# EAGLE board PowerManagementSchem (EAGLE 9.4.2)
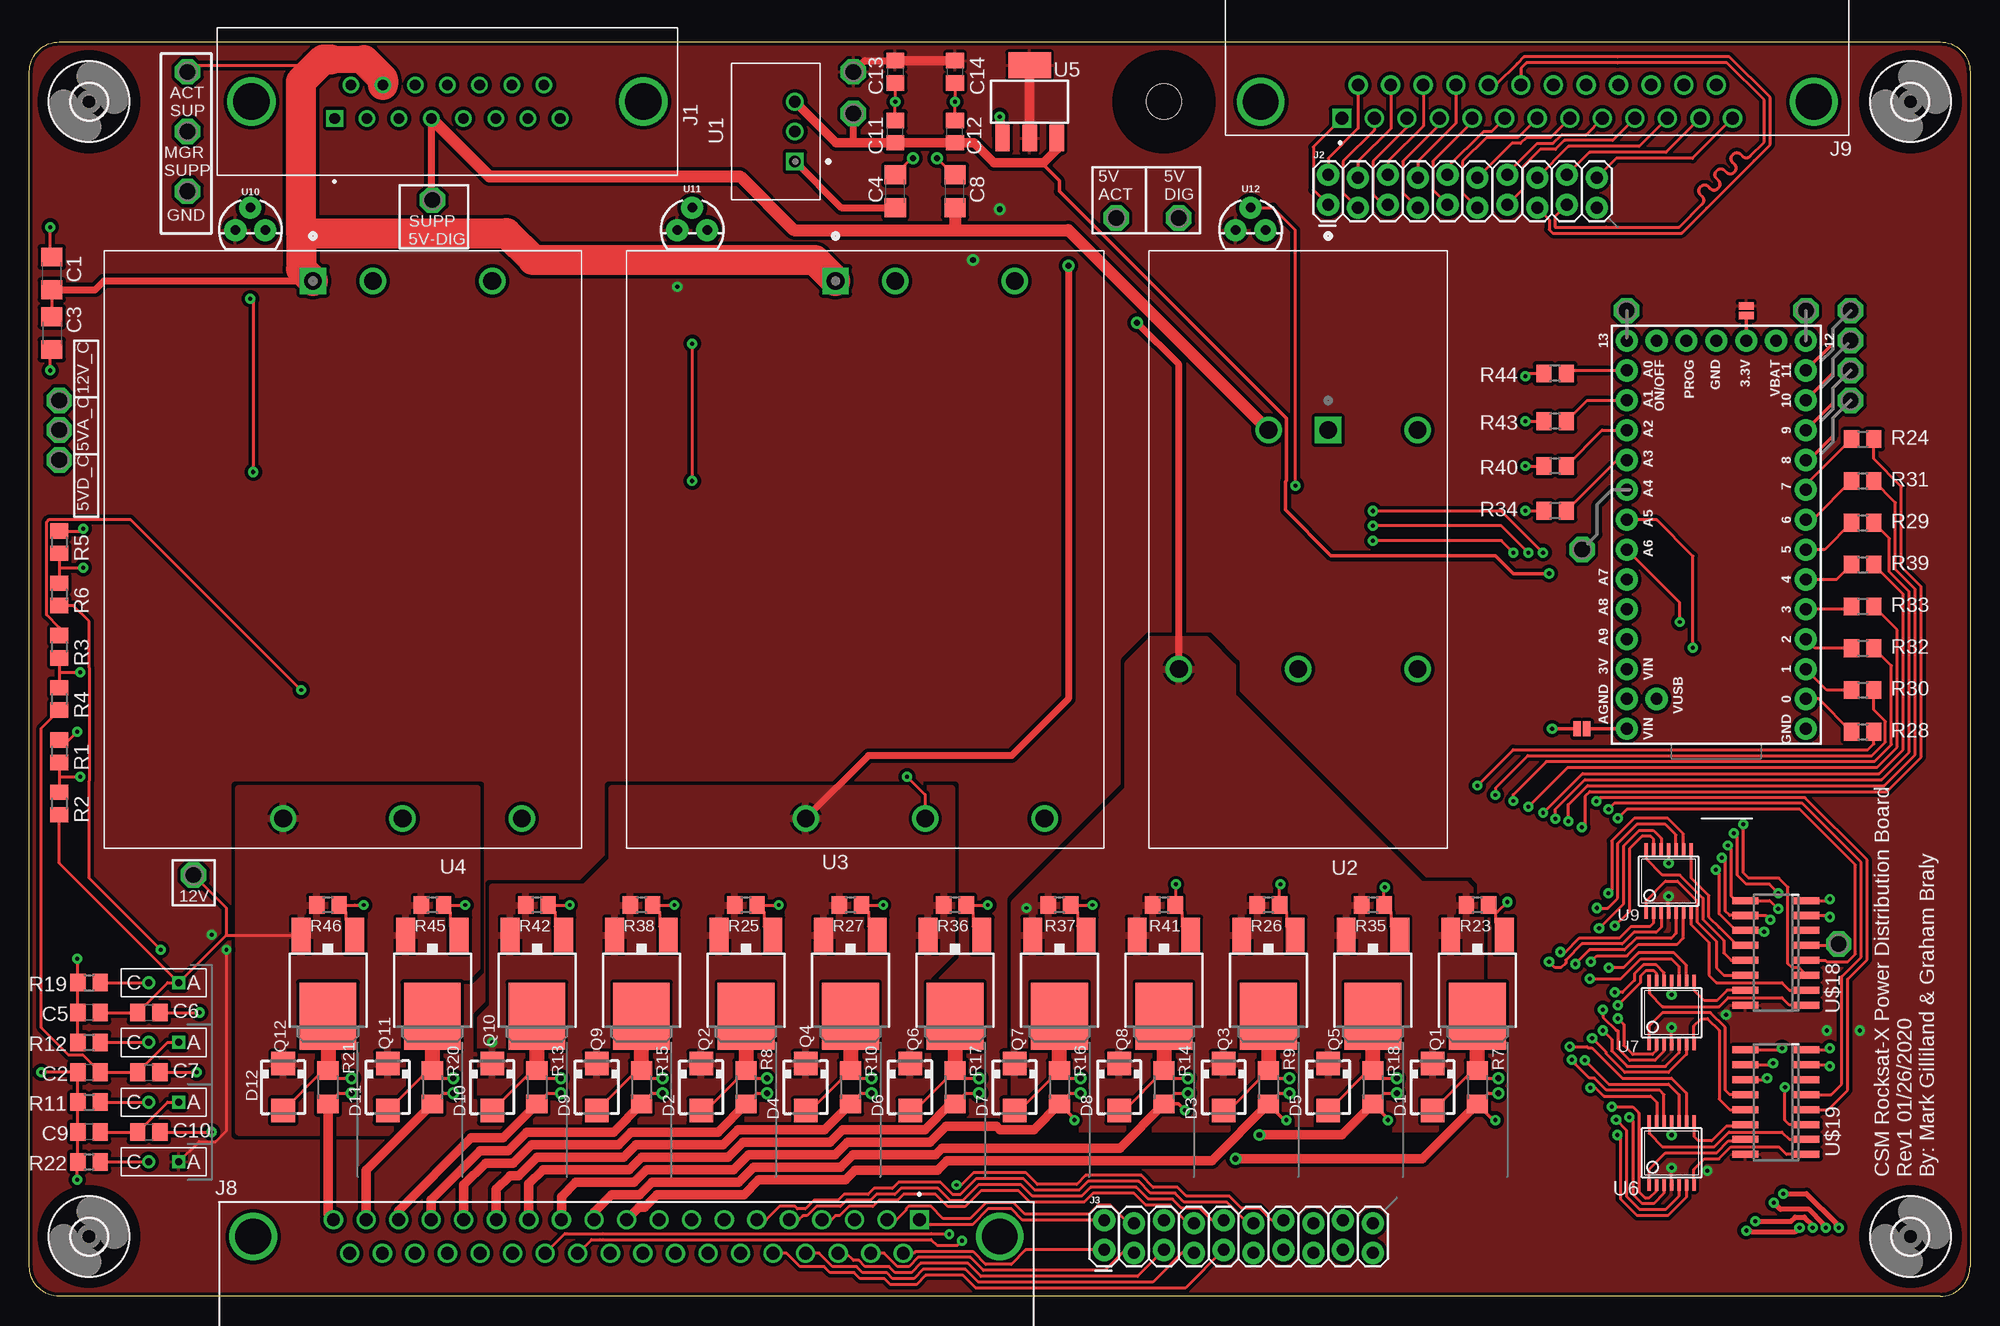
[diagram p5: board, top side]
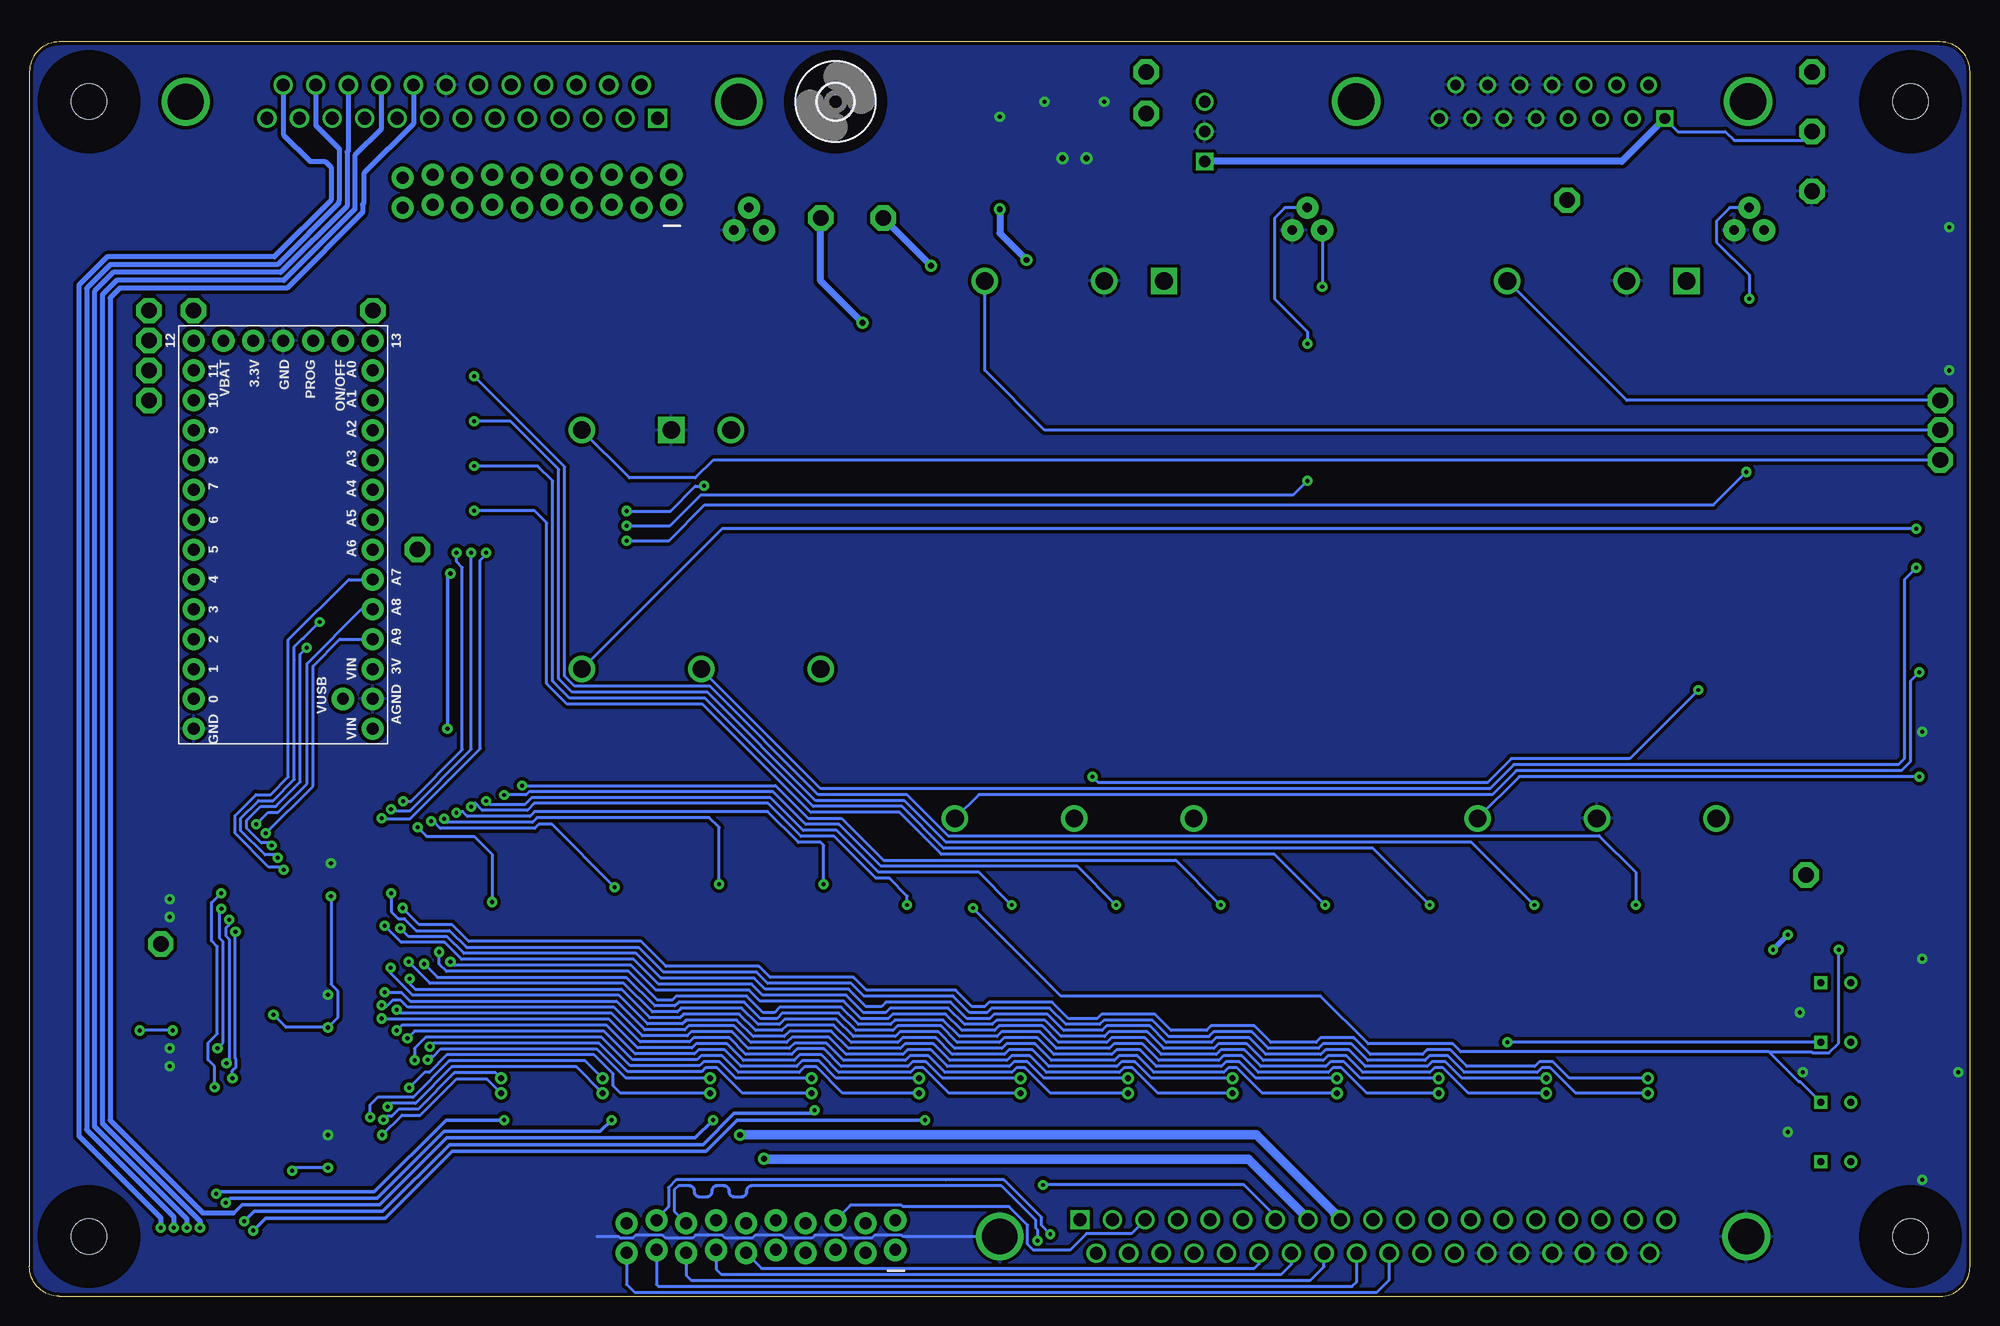
[diagram p6: board, bottom side, seen from below]

Size 165.1 x 106.68 mm. Coordinates in mm from the lower left corner, seen from the top.
Outline: 0,2.54 0,104.14 arc-90 2.54,106.68 162.56,106.68 arc-90 165.1,104.14 165.1,2.54 arc-90 162.56,0 2.54,0 arc-90 0,2.54
Copper layers (1*16): Top 0.035mm / dielectric 1.5mm / Bottom 0.035mm
Design rules "SparkFun-2-layer-STANDARD_13milDrill": minimum track width 10mil, minimum drill 13mil, track to track 10mil, track to pad 8mil, pad to pad 8mil, via to via 10mil, smd to smd 8mil, copper to edge 8mil, drill to drill 8mil, minimum pad ring 10mil, minimum via ring 10mil, stop-mask expansion 4mil, vias tented up to drill 25mil, thermal gap 10mil
Net classes: 1 USB_DIFF_PAIR: width 0.203 mm, clearance 0.203 mm to class 0, clearance 0.203 mm; 2 hv-lines: clearance 0.254 mm to class 0, clearance 0.254 mm to class 1, clearance 0.254 mm

## Footprints (pad centres in the part's own frame; a part is rotated, then mirrored left to right if it is on the bottom)
C1206 = smd 1.6 x 1.8: 1 -1.4,0; 2 1.4,0
C0805 = smd 1.3 x 1.5: 1 -0.95,0; 2 0.95,0
SMA = smd 2 x 2: A 2,0; C -2,0
3,0 = hole 3: 0,0
D15S24A4GV00LF = drill 0.9 square: 1 9.59,1.42 | drill 0.9: 2 6.85,1.42; 3 4.11,1.42; 4 1.37,1.42; 5 -1.37,1.42; 6 -4.11,1.42; 7 -6.85,1.42; 8 -9.59,1.42; 9 8.22,-1.42; 10 5.48,-1.42; 11 2.74,-1.42; 12 0,-1.42; 13 -2.74,-1.42; 14 -5.48,-1.42; 15 -8.22,-1.42 | drill 3.1: MH1 -16.66,0; MH2 16.66,0
2X10_LOCK = drill 1.016 pad 1.88: 1 0,0.127; 2 0,2.667; 3 2.54,-0.127; 4 2.54,2.413; 5 5.08,0.127; 6 5.08,2.667; 7 7.62,-0.127; 8 7.62,2.413; 9 10.16,0.127; 10 10.16,2.667; 11 12.7,-0.127; 12 12.7,2.413; 13 15.24,0.127; 14 15.24,2.667; 15 17.78,-0.127; 16 17.78,2.413; 17 20.32,0.127; 18 20.32,2.667; 19 22.86,-0.127; 20 22.86,2.413
182-037-213R531 = drill 1.09 square: 1 24.93,1.42 | drill 1.09: 2 22.16,1.42; 3 19.39,1.42; 4 16.62,1.42; 5 13.85,1.42; 6 11.08,1.42; 7 8.31,1.42; 8 5.54,1.42; 9 2.77,1.42; 10 0,1.42; 11 -2.77,1.42; 12 -5.54,1.42; 13 -8.31,1.42; 14 -11.08,1.42; 15 -13.85,1.42; 16 -16.62,1.42; 17 -19.39,1.42; 18 -22.16,1.42; 19 -24.93,1.42; 20 -23.545,-1.42; 21 -20.775,-1.42; 22 -18.005,-1.42; 23 -15.235,-1.42; 24 -12.465,-1.42; 25 -9.695,-1.42; 26 -6.925,-1.42; 27 -4.155,-1.42; 28 -1.385,-1.42; 29 1.385,-1.42; 30 4.155,-1.42; 31 6.925,-1.42; 32 9.695,-1.42; 33 12.465,-1.42; 34 15.235,-1.42; 35 18.005,-1.42; 36 20.775,-1.42; 37 23.545,-1.42 | drill 3.05: MH1 -31.75,0; MH2 31.75,0
182-025-213R531 = drill 1.09 square: 1 16.62,1.42 | drill 1.09: 2 13.85,1.42; 3 11.08,1.42; 4 8.31,1.42; 5 5.54,1.42; 6 2.77,1.42; 7 0,1.42; 8 -2.77,1.42; 9 -5.54,1.42; 10 -8.31,1.42; 11 -11.08,1.42; 12 -13.85,1.42; 13 -16.62,1.42; 14 15.235,-1.42; 15 12.465,-1.42; 16 9.695,-1.42; 17 6.925,-1.42; 18 4.155,-1.42; 19 1.385,-1.42; 20 -1.385,-1.42; 21 -4.155,-1.42; 22 -6.925,-1.42; 23 -9.695,-1.42; 24 -12.465,-1.42; 25 -15.235,-1.42 | drill 3.05: MH1 -23.52,0; MH2 23.52,0
SMT-JUMPER_2_NO_NO-SILK = smd 0.635 x 1.27: 1 -0.406,0; 2 0.406,0
DPAK = smd 1.6 x 3: 1 -2.28,-5.31; 3 2.28,-5.31 | smd 4.826 x 5.715: 4 0,1.588
R0805 = smd 1.3 x 1.5: 1 -0.95,0; 2 0.95,0
R1206 = smd 1.6 x 1.803: 1 -1.422,0; 2 1.422,0
P1-13 = drill 1.321 pad 2.159 octagon: TP 0,0
VX78012-500_VX7805-500 = drill 1 square: 1 -2.54,-1.625 | drill 1: 2 0,-1.625; 3 2.54,-1.625
CONV_PYB20-Q24-S5 = drill 1.5 square: 1 -10.16,2.54 | drill 1.5: 2 -10.16,-2.54; 3 10.16,-10.16; 4 10.16,0; 5 10.16,10.16; 6 -10.16,10.16
CONV_PYB30-Q48-S5 = drill 1.5 square: 1 -22.86,-2.54 | drill 1.5: 2 -22.86,2.54; 3 -22.86,12.7; 4 22.86,15.24; 5 22.86,5.08; 6 22.86,-5.08
CONV_PYB30-Q48-S12 = drill 1.5 square: 1 -22.86,-2.54 | drill 1.5: 2 -22.86,2.54; 3 -22.86,12.7; 4 22.86,15.24; 5 22.86,5.08; 6 22.86,-5.08
SOT223 = smd 1.219 x 2.235: 1 -2.311,-3.099; 2 0,-3.099; 3 2.311,-3.099 | smd 3.6 x 2.2: 4 0,3.099
TSSOP14 = smd 0.305 x 0.991: 1 -1.905,-2.718; 2 -1.27,-2.718; 3 -0.635,-2.718; 4 0,-2.718; 5 0.635,-2.718; 6 1.27,-2.718; 7 1.905,-2.718; 8 1.905,2.718; 9 1.27,2.718; 10 0.635,2.718; 11 0,2.718; 12 -0.635,2.718; 13 -1.27,2.718; 14 -1.905,2.718
TEENSY-4.0 = drill 1.016 pad 1.88: 0 7.62,-13.97; 1 7.62,-11.43; 2 7.62,-8.89; 3 7.62,-6.35; 3.3V 2.54,16.51; 3V -7.62,-11.43; 4 7.62,-3.81; 5 7.62,-1.27; 6 7.62,1.27; 7 7.62,3.81; 8 7.62,6.35; 9 7.62,8.89; 10 7.62,11.43; 11 7.62,13.97; 12 7.62,16.51; 13 -7.62,16.51; 14 -7.62,13.97; 15 -7.62,11.43; 16 -7.62,8.89; 17 -7.62,6.35; 18 -7.62,3.81; 19 -7.62,1.27; 20 -7.62,-1.27; 21 -7.62,-3.81; 22 -7.62,-6.35; 23 -7.62,-8.89; AGND -7.62,-13.97; GND 0,16.51; GND1 7.62,-16.51; ON/OFF -5.08,16.51; PROG -2.54,16.51; VBAT 5.08,16.51; VIN -7.62,-16.51; VUSB -5.08,-13.97
TO-92 = drill 0.813 pad 1.88: 1 -1.27,0; 2 0,1.905; 3 1.27,0
FLAT_LED = drill 0.6 square: ANODE 0,0 | drill 0.6: CATHODE 2.54,0
SOIC16N = smd 0.6 x 2.2: 1 -4.445,-2.6; 2 -3.175,-2.6; 3 -1.905,-2.6; 4 -0.635,-2.6; 5 0.635,-2.6; 6 1.905,-2.6; 7 3.175,-2.6; 8 4.445,-2.6; 9 4.445,2.6; 10 3.175,2.6; 11 1.905,2.6; 12 0.635,2.6; 13 -0.635,2.6; 14 -1.905,2.6; 15 -3.175,2.6; 16 -4.445,2.6

## Placement (x,y rotation side)
C1  10uF  [C1206]  1.91,87 90 top
C2  10uF  [C0805]  5.08,19.05 180 top
C3  10uF  [C1206]  1.91,81.92 270 top
C4  10uF  [C1206]  73.66,93.98 90 top
C5  10uF  [C0805]  5.08,24.13 180 top
C6  0.1uF  [C0805]  10.16,24.13 0 top
C7  0.1uF  [C0805]  10.16,19.05 0 top
C8  10uF  [C1206]  78.74,93.98 90 top
C9  10uF  [C0805]  5.08,13.97 180 top
C10  0.1uF  [C0805]  10.16,13.97 0 top
C11  10uF  [C0805]  73.66,99.06 90 top
C12  0.1uF  [C0805]  78.74,99.06 90 top
C13  10uF  [C0805]  73.66,104.14 270 top
C14  0.1uF  [C0805]  78.74,104.14 270 top
D1  S1M  [SMA]  119.38,17.78 270 top
D2  S1M  [SMA]  57.15,17.78 270 top
D3  S1M  [SMA]  101.6,17.78 270 top
D4  S1M  [SMA]  66.04,17.78 270 top
D5  S1M  [SMA]  110.49,17.78 270 top
D6  S1M  [SMA]  74.93,17.78 270 top
D7  S1M  [SMA]  83.82,17.78 270 top
D8  S1M  [SMA]  92.71,17.78 270 top
D9  S1M  [SMA]  48.26,17.78 270 top
D10  S1M  [SMA]  39.37,17.78 270 top
D11  S1M  [SMA]  30.48,17.78 270 top
D12  S1M  [SMA]  21.59,17.78 270 top
H1  MOUNT-HOLE3.0  [3,0]  160.02,101.6 0 top
H2  MOUNT-HOLE3.0  [3,0]  160.02,5.08 0 top
H3  MOUNT-HOLE3.0  [3,0]  5.08,101.6 0 top
H4  MOUNT-HOLE3.0  [3,0]  96.52,101.6 0 bottom
H6  MOUNT-HOLE3.0  [3,0]  5.08,5.08 0 top
J1  D15S24A4GV00LF  [D15S24A4GV00LF]  35.56,101.6 180 top
J2  [2X10_LOCK]  110.49,92.71 0 top
J3  [2X10_LOCK]  91.44,3.81 0 top
J8  182-037-213R531  [182-037-213R531]  50.8,5.08 0 top
J9  182-025-213R531  [182-025-213R531]  128.27,101.6 180 top
JP1  JUMPER-SMT_2_NO_NO-SILK  [SMT-JUMPER_2_NO_NO-SILK]  132.08,48.26 180 top
JP2  JUMPER-SMT_2_NO_NO-SILK  [SMT-JUMPER_2_NO_NO-SILK]  146.05,83.82 90 top
Q1  PMOSFET  [DPAK]  123.19,25.4 180 top
Q2  PMOSFET  [DPAK]  60.96,25.4 180 top
Q3  PMOSFET  [DPAK]  105.41,25.4 180 top
Q4  PMOSFET  [DPAK]  69.85,25.4 180 top
Q5  PMOSFET  [DPAK]  114.3,25.4 180 top
Q6  PMOSFET  [DPAK]  78.74,25.4 180 top
Q7  PMOSFET  [DPAK]  87.63,25.4 180 top
Q8  PMOSFET  [DPAK]  96.52,25.4 180 top
Q9  PMOSFET  [DPAK]  52.07,25.4 180 top
Q10  PMOSFET  [DPAK]  43.18,25.4 180 top
Q11  PMOSFET  [DPAK]  34.29,25.4 180 top
Q12  PMOSFET  [DPAK]  25.4,25.4 180 top
R1  DNP  [R0805]  2.54,46.35 270 top
R2  DNP  [R0805]  2.54,41.91 270 top
R3  DNP  [R0805]  2.54,55.24 270 top
R4  DNP  [R0805]  2.54,50.8 270 top
R5  DNP  [R0805]  2.54,64.14 270 top
R6  DNP  [R0805]  2.54,59.69 270 top
R7  0.01Ω  [R1206]  123.19,17.78 90 top
R8  0.01Ω  [R1206]  60.96,17.78 90 top
R9  0.01Ω  [R1206]  105.41,17.78 90 top
R10  0.01Ω  [R1206]  69.85,17.78 90 top
R11  330  [R0805]  5.08,16.51 0 top
R12  330  [R0805]  5.08,21.59 0 top
R13  0.01Ω  [R1206]  43.18,17.78 90 top
R14  0.01Ω  [R1206]  96.52,17.78 90 top
R15  0.01Ω  [R1206]  52.07,17.78 90 top
R16  0.01Ω  [R1206]  87.63,17.78 90 top
R17  0.01Ω  [R1206]  78.74,17.78 90 top
R18  0.01Ω  [R1206]  114.3,17.78 90 top
R19  1.2k  [R0805]  5.08,26.67 0 top
R20  0.01Ω  [R1206]  34.29,17.78 90 top
R21  0.01Ω  [R1206]  25.4,17.78 90 top
R22  330  [R0805]  5.08,11.43 0 top
R23  100k  [R0805]  123.19,33.27 180 top
R24  100Ω  [R0805]  155.96,72.9 0 top
R25  100k  [R0805]  60.96,33.27 180 top
R26  100k  [R0805]  105.41,33.27 180 top
R27  100k  [R0805]  69.85,33.27 180 top
R28  100Ω  [R0805]  155.96,48.01 0 top
R29  100Ω  [R0805]  155.96,65.79 0 top
R30  100Ω  [R0805]  155.96,51.56 0 top
R31  100Ω  [R0805]  155.96,69.34 0 top
R32  100Ω  [R0805]  155.96,55.12 0 top
R33  100Ω  [R0805]  155.96,58.67 0 top
R34  100Ω  [R0805]  129.79,66.8 180 top
R35  100k  [R0805]  114.3,33.27 180 top
R36  100k  [R0805]  78.74,33.27 180 top
R37  100k  [R0805]  87.63,33.27 180 top
R38  100k  [R0805]  52.07,33.27 180 top
R39  100Ω  [R0805]  155.96,62.23 0 top
R40  100Ω  [R0805]  129.79,70.61 180 top
R41  100k  [R0805]  96.52,33.27 180 top
R42  100k  [R0805]  43.18,33.27 180 top
R43  100Ω  [R0805]  129.79,74.42 180 top
R44  100Ω  [R0805]  129.79,78.49 180 top
R45  100k  [R0805]  34.29,33.27 180 top
R46  100k  [R0805]  25.4,33.27 180 top
TP1  TPPAD1-13  [P1-13]  13.46,93.98 180 top
TP2  TPPAD1-13  [P1-13]  34.29,93.22 180 top
TP3  TPPAD1-13  [P1-13]  13.46,104.14 180 top
TP4  TPPAD1-13  [P1-13]  13.46,99.06 180 top
TP5  TPPAD1-13  [P1-13]  70.1,100.58 90 top
TP6  TPPAD1-13  [P1-13]  70.1,104.14 90 top
TP7  TPPAD1-13  [P1-13]  97.79,91.69 0 top
TP8  TPPAD1-13  [P1-13]  92.46,91.69 0 top
TP9  TPPAD1-13  [P1-13]  13.97,35.81 180 top
TP10  TPPAD1-13  [P1-13]  154.94,76.2 0 top
TP11  TPPAD1-13  [P1-13]  154.94,78.74 0 top
TP12  TPPAD1-13  [P1-13]  135.89,83.82 0 top
TP13  TPPAD1-13  [P1-13]  151.13,83.82 0 top
TP14  TPPAD1-13  [P1-13]  154.94,83.82 0 top
TP15  TPPAD1-13  [P1-13]  154.94,81.28 0 top
TP16  TPPAD1-13  [P1-13]  132.08,63.5 0 top
TP-AUX-MUX  TPPAD1-13  [P1-13]  153.92,29.97 0 top
TP_5V-ACT_CTRL  TPPAD1-13  [P1-13]  2.54,73.66 180 top
TP_5V-DIG_CTRL  TPPAD1-13  [P1-13]  2.54,71.12 180 top
TP_12V_CTRL  TPPAD1-13  [P1-13]  2.54,76.2 180 top
U1  VX7805-500  [VX78012-500_VX7805-500]  63.5,99.06 90 top
U2  PYB20-Q24-S5  [CONV_PYB20-Q24-S5]  107.95,63.5 270 top
U3  PYB30-Q48-S5  [CONV_PYB30-Q48-S5]  71.12,63.5 270 top
U4  PYB30-Q48-S12  [CONV_PYB30-Q48-S12]  26.67,63.5 270 top
U5  3V3REG  [SOT223]  85.09,101.6 0 top
U6  INA4180-SPLIT  [TSSOP14]  139.7,12.19 0 top
U7  INA4180-SPLIT  [TSSOP14]  139.7,24.13 0 top
U8  TEENSY-4.0SILK  [TEENSY-4.0]  143.51,64.77 0 top
U9  INA4180-SPLIT  [TSSOP14]  139.45,35.31 0 top
U10  TMP36  [TO-92]  18.8,90.68 0 top
U11  TMP36  [TO-92]  56.39,90.68 0 top
U12  TMP36  [TO-92]  103.89,90.68 0 top
U$9  FLAT_LED  [FLAT_LED]  12.7,16.51 180 top
U$10  FLAT_LED  [FLAT_LED]  12.7,21.59 180 top
U$17  FLAT_LED  [FLAT_LED]  12.7,26.67 180 top
U$18  CD4051B_ALT  [SOIC16N]  148.59,29.21 90 top
U$19  CD4051B_ALT  [SOIC16N]  148.59,16.51 90 top
U$20  FLAT_LED  [FLAT_LED]  12.7,11.43 180 top

## Tracks (layer width: path | path; a pad name or v marks a point on that pad's centre or on a via)
5V-ACT  (via drill 0.33, 0.5)
  Top 0.254: U$10.ANODE 11.75,21.59 C7.1 C2.1 4.57,20.51 3.34,20.51 1.02,22.84 1.02,48.33 R4.2
  Top 0.61: v88.39,87.63 88.39,50.8 83.57,45.97 71.37,45.97 U3.6
  Bottom 0.254: U$10.ANODE v39.37,21.59
  Bottom 0.61: TP8.TP v88.39,87.63
  pour Top: 78.49,43.18 49.53,43.18 49.53,37.08 47.24,34.8 39.37,34.8 39.37,24.64 38.35,23.62 38.35,13.97 76.45,13.97 76.45,27.18 78.49,29.21
5V-ACT-CAM  (via drill 0.35, 0.51)
  Top 0.254: R17.1 79.65,17.27 v80.77,17.27 | v135.13,23.62 135.64,23.11 135.64,21.34 136.4,20.57 138.07,20.57 138.43,20.93 U7.2
  Top 0.813: R17.1 78.37,16.36 76.18,14.17 69.17,14.17 68.1,13.1 60.72,13.1 59.46,11.84 52.07,11.84 51.01,10.77 43.69,10.77 42.49,9.57 J8.13
  Bottom 0.254: v80.77,17.27 86.88,17.27 89.04,19.43 89.78,19.43 90.16,19.05 96.25,19.05 97.72,20.52 99.58,20.52 100.04,20.07 104.36,20.07 105.76,21.46 108.4,21.46 108.73,21.13 113.36,21.13 115.79,23.57 135.08,23.57 v135.13,23.62
5V-ACT-CAM-EN
  Top 0.254: R32.1 151.89,55.12 U8.2
5V-ACT-CAM-SNS
  Top 0.254: U7.1 137.79,22.99 138.94,24.13 143,24.13 144.27,22.86 144.27,17.53 144.65,17.14 U$19.12
5V-ACT-CTRL
  Bottom 0.254: U3.3 83.82,78.74 78.74,73.66 TP_5V-ACT_CTRL.TP
5V-ACT-LASER  (via drill 0.35, 0.51)
  Top 0.254: R10.1 70.76,17.27 v71.63,17.27 | v135.13,24.73 137.06,26.66 137.06,27.23 137.52,27.69 138.18,27.69 138.43,27.43 U7.13
  Top 0.813: R10.1 67.66,14.17 60.28,14.17 59.01,12.9 51.63,12.9 50.57,11.84 43.18,11.84 41.61,10.26 40.89,10.26 39.72,9.09 J8.14
  Bottom 0.254: v71.63,17.27 78.25,17.27 80.4,19.43 81.14,19.43 81.52,19.05 87.22,19.05 88.62,20.45 90.2,20.45 90.58,20.07 95.83,20.07 97.3,21.54 100,21.54 100.46,21.08 103.94,21.08 105.34,22.48 108.82,22.48 109.15,22.15 112.93,22.15 115.37,24.59 132.92,24.59 133.52,25.19 134.19,25.19 134.8,24.59 134.98,24.59 v135.13,24.73
5V-ACT-LASER-EN
  Top 0.254: R30.1 152.91,51.56 U8.1
5V-ACT-LASER-SNS
  Top 0.254: U7.14 137.79,25.78 138.94,24.64 143.76,24.64 144.53,25.4 149.1,25.4 149.73,24.77 U$18.1
5V-ACT-MAG  (via drill 0.35, 0.51)
  Top 0.254: R13.1 44.09,17.27 v45.21,17.27 | v130.24,29.28 130.66,29.28 131.87,30.48 135.28,30.48 136.26,31.46 137.89,31.46 138.18,31.75 U9.2
  Top 0.813: R13.1 40.28,13.46 37.59,13.46 31.41,7.28 J8.17
  Bottom 0.254: v45.21,17.27 51.32,17.27 53.48,19.43 54.22,19.43 54.6,19.05 60.55,19.05 61.95,20.45 63.53,20.45 63.91,20.07 69.02,20.07 70.42,21.46 72.84,21.46 73.22,21.08 77.74,21.08 79.14,22.48 82.4,22.48 82.78,22.1 85.96,22.1 87.36,23.5 91.46,23.5 91.84,23.11 94.57,23.11 96.04,24.59 101.27,24.59 101.72,24.13 102.68,24.13 104.08,25.53 110.08,25.53 110.41,25.2 111.67,25.2 114.11,27.64 129.62,27.64 130.24,28.25 v130.24,29.28
5V-ACT-MAG-EN
  Top 0.254: R40.1 133.79,73.66 U8.16
5V-ACT-MAG-SNS
  Top 0.254: U9.1 137.54,33.66 139.19,35.31 140.21,35.31 141.86,33.66 141.86,31.83 142.73,30.97 142.75,30.94 143.51,30.18 143.51,27.94 144.15,27.3 U$18.14
5V-ACT-STA  (via drill 0.35, 0.51)
  Top 0.254: R15.1 52.98,17.27 v53.85,17.27 | v132.84,28.45 133.35,28.96 135.91,28.96 136.9,29.94 140.17,29.94 140.72,30.48 U9.6
  Top 0.813: R15.1 49.68,13.97 42.3,13.97 40.73,12.39 38.35,12.39 34.18,8.22 J8.16
  Bottom 0.254: v53.85,17.27 60.21,17.27 62.37,19.43 63.11,19.43 63.49,19.05 69.44,19.05 70.84,20.45 72.42,20.45 72.8,20.07 78.17,20.07 79.56,21.46 81.98,21.46 82.36,21.08 86.38,21.08 87.78,22.48 91.04,22.48 91.42,22.1 94.99,22.1 96.46,23.57 100.84,23.57 101.3,23.11 103.1,23.11 104.5,24.51 109.66,24.51 109.99,24.18 112.09,24.18 114.53,26.62 131.01,26.62 v132.84,28.45
5V-ACT-STA-EN
  Top 0.254: R34.1 135.06,71.12 U8.17
5V-ACT-STA-SNS
  Top 0.254: U$18.2 149.73,26.04 149.1,26.67 143.51,26.67 142.88,27.3 142.88,30.1 141.35,31.62 U9.7
5V-ACT-TRIM  (via drill 0.35)
  Top 0.254: R3.2 2.54,53.09 | 2.54,53.09 R4.1 | 2.54,53.09 v4.32,53.09
  Bottom 0.254: v4.32,53.09 5.08,52.32 5.08,45.47 5.84,44.7 38.61,44.7 40.64,42.67 84.33,42.67 U3.4
5V-ACT-TX  (via drill 0.35, 0.51)
  Top 0.254: R8.1 61.87,17.27 v62.74,17.27 | v134.37,27.94 135.62,27.94 136.89,29.21 139.91,29.21 140.97,28.15 U7.9
  Top 0.813: R8.1 58.57,13.97 51.19,13.97 50.12,12.9 42.74,12.9 41.17,11.33 38.8,11.33 36.95,9.48 J8.15
  Bottom 0.254: v62.74,17.27 69.1,17.27 71.26,19.43 72,19.43 72.38,19.05 78.59,19.05 79.98,20.45 81.56,20.45 81.94,20.07 86.8,20.07 88.2,21.46 90.62,21.46 91,21.08 95.41,21.08 96.88,22.55 100.42,22.55 100.88,22.1 103.52,22.1 104.92,23.5 109.24,23.5 109.57,23.16 112.51,23.16 114.95,25.6 132.5,25.6 134.37,27.47 v134.37,27.94
5V-ACT-TX-EN
  Top 0.254: R28.1 152.21,50.8 U8.0
5V-ACT-TX-SNS
  Top 0.254: U7.8 141.6,26.04 142.49,25.15 143.55,25.15 144.44,26.04 U$18.15
5V-DIG  (via drill 0.33, 0.5)
  Top 0.254: C9.1 C10.1 11.75,16.51 U$9.ANODE | v11.18,29.46 5.08,35.56 5.08,43.81 5.13,43.86 5.13,53.42 5.08,53.47 5.08,57.4 3.74,58.74 R6.2
  Top 0.61: U2.3 97.79,79.25 v94.23,82.8
  Bottom 0.254: U$9.ANODE 14.43,18.24 14.56,18.24 17.11,20.79 | 17.11,20.79 43.33,20.79 44,21.46 51.2,21.46 55.27,25.53 77.34,25.53 v84.84,33.02 | 17.11,20.79 13.47,20.79 13.39,20.71 12.01,20.71 11.18,21.54 v11.18,29.46
  Bottom 0.61: v94.23,82.8 97.79,86.36 TP7.TP
  pour Top: 83.82,14.22 83.82,33.53 85.85,35.56 93.47,43.18 93.47,53.85 95.5,55.88 100.08,55.88 102.36,53.59 102.36,51.05 118.36,35.05 122.17,35.05 123.44,33.78 123.44,14.22
5V-DIG-CAM  (via drill 0.35, 0.5, 0.51)
  Top 0.254: R18.1 115.21,17.27 v116.33,17.27 | U6.2 138.43,8.99 137.82,8.38 137.41,8.38 136.91,8.89 136.91,15.6 136.4,16.11 v134.62,16.11
  Top 0.305: R18.1 115.57,15.09 v115.57,14.99
  Top 0.406: v152.81,5.84 152.59,6.07 152.59,6.21 151.41,7.39 148.97,7.39 v148.41,7.95
  Top 0.813: R18.1 111.66,13.72 v104.65,13.72
  Bottom 0.254: v116.33,17.27 118.57,19.51 129.16,19.51 132.26,16.41 134.32,16.41 v134.62,16.11
  Bottom 0.305: v115.57,14.99 116.53,14.02 129.83,14.02 135.52,8.33 148.03,8.33 v148.41,7.95
  Bottom 0.406: J9.24 140.74,99.59 138.74,97.59 138.74,93.22 138.79,93.17 138.79,92.94 144,87.73 158.22,87.73 160.22,85.73 160.22,14.16 152.81,6.75 v152.81,5.84
  Bottom 0.813: J8.9 54.08,7.01 54.08,7.09 60.71,13.72 v104.65,13.72
5V-DIG-CAM-EN
  Top 0.254: R31.1 151.7,66.04 U8.6
5V-DIG-CAM-SNS
  Top 0.254: U6.1 137.79,10.79 139.19,12.19 143.53,12.19 144.55,13.21 145.86,13.21 U$19.15
5V-DIG-CTRL
  Bottom 0.254: TP_5V-DIG_CTRL.TP 106.93,71.12 108.46,69.6 114.05,69.6 U2.6
5V-DIG-LASER  (via drill 0.35, 0.51)
  Top 0.254: R9.1 106.32,17.27 v107.19,17.27 | v132.8,17.73 133.23,17.73 133.94,17.02 137.92,17.02 138.43,16.51 U6.13
  Top 0.305: R9.1 106.78,14.99 v106.93,14.99
  Top 0.813: R9.1 100.58,11.53 78.07,11.53 77.25,10.72 70.24,10.72 69.43,9.9 62.05,9.9 60.78,8.64 53.4,8.64 52.33,7.57 51.87,7.57 J8.10
  Bottom 0.254: v107.19,17.27 114.81,17.27 115.44,17.91 115.44,18.91 117.06,20.52 129.59,20.52 131.06,19.05 131.49,19.05 v132.8,17.73
  Bottom 0.305: v106.93,14.99 108.46,13.46 129.6,13.46 135.29,7.77 147.01,7.77 147.72,7.06
  Bottom 0.406: J9.21 132.43,99.73 136.65,95.5 136.65,92.96 136.75,92.86 136.75,92.17 143.18,85.75 157.4,85.75 158.24,84.91 158.24,14.99 150.32,7.06 147.72,7.06
5V-DIG-LASER-EN
  Top 0.254: R29.1 152.72,63.5 U8.5
5V-DIG-LASER-SNS
  Top 0.254: U6.14 137.79,13.84 138.94,12.7 143.32,12.7 144.59,13.96 149.09,13.96 149.1,13.97 149.73,13.34 U$19.2
5V-DIG-MAG  (via drill 0.35, 0.51)
  Top 0.254: v98.55,17.27 97.43,17.27 R14.1 | v131.03,21.24 132.5,21.24 132.61,21.13 132.92,21.13 135.51,18.54 139.7,18.54 140.97,17.27 U6.9
  Top 0.305: R14.1 97.76,16.36 v98.3,15.82
  Top 0.406: v146.84,6.37 149.87,6.37 150.22,6.73 151.01,6.73 151.7,6.03 v151.7,5.84
  Top 0.813: R14.1 92.76,12.6 77.62,12.6 77.07,12.04 70.06,12.04 68.99,10.97 61.61,10.97 60.34,9.7 52.96,9.7 51.89,8.64 49.53,8.64 48.03,7.14 J8.11
  Bottom 0.254: v98.55,17.27 104.44,17.27 106.6,19.43 107.56,19.43 107.89,19.1 114.2,19.1 116.64,21.54 130.73,21.54 v131.03,21.24
  Bottom 0.305: v98.3,15.82 98.58,15.54 105.13,15.54 107.78,12.9 129.37,12.9 135.06,7.21 146,7.21 v146.84,6.37
  Bottom 0.406: J9.23 137.97,97.41 138.07,97.3 138.07,92.72 143.72,87.07 157.95,87.07 159.56,85.46 159.56,14.44 151.7,6.58 v151.7,5.84
5V-DIG-MAG-EN
  Top 0.254: R39.1 153.74,60.96 U8.4
5V-DIG-MAG-SNS
  Top 0.254: U6.8 141.6,13.59 141.99,13.21 143.11,13.21 144.38,14.47 145.86,14.47 U$19.14
5V-DIG-STA  (via drill 0.35, 0.51)
  Top 0.254: R16.1 88.54,17.27 v89.41,17.27 | v132.94,21.94 134.11,20.77 134.11,20.66 135.72,19.05 139.45,19.05 140.97,20.57 U7.6
  Top 0.305: R16.1 88.9,15.09 v88.9,14.99
  Top 0.406: v146.05,5.59 146.37,5.59 146.47,5.49 150.23,5.49 v150.59,5.84
  Top 0.813: R16.1 85.44,14.17 82.57,14.17 82.26,14.48 78,14.48 76.62,13.1 69.61,13.1 68.55,12.04 61.16,12.04 59.9,10.77 52.52,10.77 51.45,9.7 46.48,9.7 45.26,8.48 J8.12
  Bottom 0.254: v89.41,17.27 95.91,17.27 98.15,19.51 99.16,19.51 99.62,19.05 104.79,19.05 106.18,20.45 107.98,20.45 108.31,20.12 113.78,20.12 116.21,22.55 132.33,22.55 v132.94,21.94
  Bottom 0.305: v88.9,14.99 104.9,14.99 107.54,12.34 129.13,12.34 134.82,6.66 144.98,6.66 v146.05,5.59
  Bottom 0.406: J9.22 135.19,99.25 137.41,97.03 137.41,92.45 143.45,86.41 157.68,86.41 158.9,85.18 158.9,14.71 150.59,6.4 v150.59,5.84
5V-DIG-STA-EN
  Top 0.254: R33.1 154.75,58.42 U8.3
5V-DIG-STA-SNS
  Top 0.254: U7.7 141.6,22.99 142.24,23.62 142.75,23.62 143.76,22.61 143.76,16.76 144.65,15.88 U$19.13
5V-DIG-TRIM  (via drill 0.35)
  Top 0.254: R5.2 2.54,61.98 | 2.54,61.98 R6.1 | 2.54,61.98 v4.57,61.98
  Bottom 0.254: v4.57,61.98 5.59,60.96 5.59,45.72 6.1,45.21 38.82,45.21 40.85,43.18 97.79,43.18 U2.4
5V-DIG-TX  (via drill 0.35, 0.5, 0.51)
  Top 0.254: R7.1 124.1,17.27 v124.97,17.27 | U6.6 140.97,8.43 139.4,6.86 136.78,6.86 135.38,8.26 135.38,13.41 v135.08,13.72
  Top 0.305: R7.1 124.56,14.99 v124.71,14.99
  Top 0.406: v153.92,5.84 153.7,6.07 153.7,6.21 151.17,8.73 v149.19,8.73
  Top 0.813: R7.1 118.52,11.68 v102.62,11.68
  Bottom 0.254: v124.97,17.27 126.19,18.49 128.74,18.49 131.84,15.4 133.4,15.4 v135.08,13.72
  Bottom 0.305: v124.71,14.99 129.65,14.99 135.75,8.89 149.04,8.89 v149.19,8.73
  Bottom 0.406: J9.25 143.5,98.8 141.22,96.52 139.95,96.52 139.45,96.01 139.45,93.22 144.27,88.39 158.5,88.39 160.88,86 160.88,13.64 153.92,6.67 v153.92,5.85 v153.92,5.84
  Bottom 0.813: v102.62,11.68 102.56,11.63 61.4,11.63 56.34,6.57 J8.8
5V-DIG-TX-EN
  Top 0.254: R24.1 151.13,69.02 U8.7
5V-DIG-TX-SNS
  Top 0.254: U6.7 141.6,10.79 142.49,11.68 143.74,11.68 144.76,12.7 148.84,12.7 149.48,12.06 U$19.1
12V
  Top 0.254: C5.1 C6.1 11.75,26.67 U$17.ANODE | U$17.ANODE 16.74,30.71 16.76,30.71 | 16.76,30.71 Q12.3 | U$17.ANODE 2.54,36.83 R2.2 | 16.76,30.71 16.76,33.02 TP9.TP
  pour Top (isolate 0.305): 17.78,43.18 17.78,13.97 31.75,13.97 31.75,21.59 38.1,27.94 38.1,43.18
12V-CAM  (via drill 0.35, 0.51)
  Top 0.254: R20.1 35.2,17.27 v36.07,17.27 | v134.87,31.5 136.14,32.77 136.14,38.1 137.16,39.12 137.92,39.12 138.18,38.86 U9.13
  Top 0.813: R20.1 28.64,10.71 J8.18
  Bottom 0.254: v36.07,17.27 42.69,17.27 44.84,19.43 45.58,19.43 45.96,19.05 51.66,19.05 53.06,20.45 54.64,20.45 55.02,20.07 60.13,20.07 61.53,21.46 63.95,21.46 64.33,21.08 68.6,21.08 70,22.48 73.26,22.48 73.64,22.1 77.32,22.1 78.72,23.5 82.82,23.5 83.2,23.11 85.54,23.11 86.94,24.51 91.88,24.51 92.26,24.13 94.15,24.13 95.62,25.6 102.72,25.6 103.66,26.54 111.58,26.54 113.69,28.65 128.34,28.65 129.78,30.09 133.47,30.09 v134.87,31.5
12V-CAM-EN
  Top 0.254: R43.1 132.52,76.2 U8.15
12V-CAM-SNS
  Top 0.254: U9.14 137.54,37.21 138.94,35.81 140.42,35.81 142.37,33.87 142.37,32.04 144.15,30.27 144.15,29.21 144.78,28.57 U$18.13
12V-CTRL
  Bottom 0.254: TP_12V_CTRL.TP 29.21,76.2 U4.3
12V-STA  (via drill 0.35, 0.51)
  Top 0.254: R21.1 26.31,17.27 v27.43,17.27 | U9.9 140.72,39.33 139.4,40.64 136.53,40.64 134.62,38.73 134.62,34.59 v134.32,34.29
  Top 0.813: R21.1 25.4,6.97 J8.19
  Bottom 0.254: v27.43,17.27 33.54,17.27 35.7,19.43 36.44,19.43 36.82,19.05 43.03,19.05 44.42,20.45 46,20.45 46.38,20.07 51.24,20.07 52.64,21.46 55.06,21.46 55.44,21.08 59.71,21.08 61.11,22.48 64.37,22.48 64.75,22.1 68.18,22.1 69.58,23.5 69.6,23.5 73.68,23.5 74.06,23.11 76.9,23.11 78.3,24.51 83.24,24.51 83.62,24.13 85.12,24.13 86.52,25.53 94.11,25.53 95.2,26.62 102.3,26.62 103.24,27.56 111.16,27.56 113.27,29.67 127.92,29.67 129.36,31.1 132.19,31.1 133.2,32.12 133.72,32.12 134.32,32.72 v134.32,34.29
12V-STA-EN
  Top 0.254: R44.1 131,78.74 U8.14
12V-STA-SNS
  Top 0.254: U9.8 141.35,35.6 142.88,34.08 142.88,32.25 143.76,31.37 143.76,31.36 145.21,29.93 145.21,29.84 U$18.12
12V-TRIM  (via drill 0.35)
  Top 0.254: R1.2 2.54,44.2 | 2.54,44.2 R2.1 | 2.54,44.2 v4.32,44.2
  Bottom 0.254: v4.32,44.2 38.35,44.2 U4.4
ANT-BUSY
  Top 0.254: J9.3 117.19,99.41 114.3,96.52 114.3,93.73 115.19,92.84 J2.5
ANT-BUSY_2
  Bottom 0.254: J8.3 71.36,5.33 75.18,5.33 76.59,3.92 79.68,3.92 80.19,4.43 80.19,6.06 81.75,7.62 90.79,7.62 90.91,7.75 95.25,7.75 J3.6
ANT-MISO
  Top 0.254: J9.15 115.81,99.3 113.03,96.52 J2.4
ANT-MISO_2
  Top 0.254: J3.3 92.98,3.68 91.51,2.21 81.15,2.21 80.05,3.3 75.61,3.3 74.82,2.51 73.87,2.51 72.72,3.66 J8.36
ANT-MOSI
  Top 0.254: J9.14 113.03,99.32 110.49,96.77 J2.2
ANT-MOSI_2
  Top 0.254: J3.1 84.75,3.94 83.53,2.72 81.36,2.72 80.26,3.81 75.4,3.81 75.25,3.66 J8.37
ANT-SCK
  Top 0.254: J9.16 118.58,99.53 115.57,96.52 J2.6
ANT-SCK_2
  Top 0.254: J3.5 94.28,1.7 80.94,1.7 79.84,2.79 75.82,2.79 75.03,2 73.66,2 73.15,2.51 71.1,2.51 70.56,3.05 70.1,3.05 69.49,3.66 J8.35
ANT-SS
  Top 0.254: J9.17 121.34,99.75 118.11,96.52 J2.8
ANT-SS_2
  Top 0.254: J3.7 98.06,3.68 95.57,1.19 83.31,1.19 80.73,1.19 79.63,2.29 76.03,2.29 75.24,1.5 73.45,1.5 72.94,2 70.89,2 70.38,2.51 68.33,2.51 67.18,3.66 J8.34
BOOM-I2C-SCL
  Top 0.254: J9.13 141.48,96.77 135,96.77 J2.20
BOOM-I2C-SCL_2
  Bottom 0.254: J3.19 114.3,1.02 113.61,0.33 50.47,0.33 49.41,1.39 J8.28
BOOM-I2C-SDA
  Top 0.254: J9.12 139.22,97.28 132.72,97.28 J2.18
BOOM-I2C-SDA_2
  Bottom 0.254: J3.17 111.76,1.02 111.58,0.84 52.58,0.84 52.19,1.23 J8.29
CAM-USB_N
  Top 0.254: 140.36,90.93 134.11,90.93 129.79,90.93 | J9.19 126.89,104.43 127.36,104.9 135.13,104.9 144.42,104.9 147.57,101.75 147.57,98.15 146.38,96.95 arc-90 145.75,96.95 145.57,97.13 arc90 144.95,97.13 144.89,97.07 arc90 144.89,96.44 145.06,96.27 arc-90 145.06,95.64 145.01,95.58 arc-90 144.38,95.58 144.2,95.76 arc90 143.57,95.76 143.52,95.7 arc90 143.52,95.07 143.69,94.9 arc-90 143.69,94.27 143.64,94.21 arc-90 143.01,94.21 142.83,94.39 arc90 142.21,94.39 142.15,94.33 arc90 142.15,93.7 142.32,93.53 arc-90 142.32,92.9 140.36,90.93 | J2.17 129.79,91.82 129.79,90.93 | 129.79,90.93 | 140.36,90.93
CAM-USB_P
  Top 0.254: 148.08,97.94 148.08,98.04 | 148.08,98.04 148.08,101.96 144.63,105.41 135.13,105.41 127.15,105.41 126.57,104.83 124.76,103.02 J9.18 | J2.15 129.29,91.57 129.29,90.72 129.58,90.42 140.57,90.42 142.68,92.54 146.74,96.59 148.08,97.94 | 148.08,97.94 148.08,98.04
CURRENT-SNS-A  (via drill 0.33)
  Top 0.254: U$18.3 150.55,27.95 149.95,27.95 149.61,28.29 149.61,34.8 148.84,35.56 146.26,35.56 145.8,36.02 v145.8,40.13
  Bottom 0.254: v145.8,40.13 144.78,41.15 143.94,41.15 141.48,43.61 141.48,53.8 136.86,58.42 U8.22
CURRENT-SNS-B  (via drill 0.33, 0.35)
  Top 0.254: U$19.3 149.73,14.61 149.35,14.99 v149.35,17.78 | v148.8,34.29 148.03,35.05 146.05,35.05 145.29,35.81 145.29,39.08 v145,39.37
  Bottom 0.254: v149.35,17.78 149.35,19.56 149.91,20.11 149.91,21.54 149.12,22.33 149.12,29.74 149.61,30.23 149.61,33.48 v148.8,34.29 | v145,39.37 140.97,43.4 140.97,53.59 138.68,55.88 U8.23
GND  (via drill 0.35, 0.51)
  Top 0.254: C13.2 v73.66,101.6 C11.2 | C14.2 v78.74,101.6 C12.2 | C4.2 75.05,96.77 v75.18,96.77 | C8.2 78.61,95.38 v77.22,96.77 | U9.11 v139.45,36.83 | U7.11 v139.7,25.65 | U6.11 v139.7,13.72 | U$19.8 153.03,20.95 v153.16,21.08 | U$19.7 153.03,19.68 v153.16,19.56 | U$18.8 153.03,33.66 v153.16,33.78 | U$18.7 153.03,32.38 v153.16,32.26 | v4.06,9.91 4.06,11.36 R22.1 C9.2 R11.1 C2.2 v1.02,19.05 | R12.1 C5.2 R19.1 4.13,28.64 v4.06,28.7 | C7.2 v14.22,19.05 | C6.2 v14.48,24.13 | C10.2 v15.49,13.97 | v4.06,48.01 3.36,47.3 R1.1 | C1.2 1.78,88.52 v1.78,90.93 | v1.78,78.74 1.78,80.39 C3.2
  Top 0.813: U5.1 82.55,98.73 v82.55,100.33
  Bottom 0.254: J8.MH2 90.79,5.08 90.91,5.21 93.2,5.21 93.45,4.95 95.74,4.95 95.99,5.21 98.28,5.21 98.53,4.95 100.82,4.95 101.07,5.21 103.36,5.21 103.61,4.95 105.9,4.95 106.15,5.21 108.44,5.21 108.69,4.95 110.98,4.95 111.23,5.21 113.52,5.21 113.77,4.95 114.83,4.95 114.95,5.08 116.84,5.08
  pour Bottom (isolate 0.305): 0,0 165.1,0 165.1,106.68 0,106.68
LASER-I2C-SCL
  Top 0.254: J9.7 126.64,98.55 123.95,98.55 121.92,96.52 121.92,93.85 J2.11
LASER-I2C-SCL_2
  Top 0.254: J3.12 103.65,6.22 101.87,8 98.23,8 97.47,8.76 95.39,8.76 94.38,9.78 90.07,9.78 89.31,9.02 85.6,9.02 | 85.6,9.02 85.55,9.02 | 85.6,9.02 85.55,9.02 | 85.55,9.02 84.58,9.98 80.52,9.98 79.17,8.64 78.57,8.64 77.53,9.68 73.93,9.68 73.43,9.17 71.85,9.17 71.34,8.66 69.29,8.66 68.79,8.16 66.73,8.16 66.01,7.43 65.34,7.43 65.12,7.65 63.82,7.65 62.67,6.5 J8.6
LASER-I2C-SDA
  Top 0.254: J9.6 124.38,99.06 123.7,99.06 120.65,96.01 J2.10
LASER-I2C-SDA_2
  Top 0.254: J3.9 98.35,0.69 92.2,0.69 | 92.2,0.69 | 92.2,0.69 80.52,0.69 79.42,1.78 76.24,1.78 75.45,0.99 73.24,0.99 72.73,1.5 70.68,1.5 70.17,2 68.12,2 67.61,2.51 66.29,2.51 66.04,2.51 | 66.04,2.51 | 66.04,2.51 65.56,2.51 64.41,3.66 J8.33
LASER-UART-1
  Top 0.254: J9.1 109.22,97.75 109.22,94.11 J2.1
LASER-UART-1_2
  Top 0.254: J3.2 84.5,6.48 83.53,7.44 81.57,7.44 80.22,6.1 76.13,6.1 J8.1
LASER-UART-2
  Top 0.254: J9.2 114.42,99.18 111.76,96.52 111.76,93.85 J2.3
LASER-UART-2_2
  Top 0.254: J3.4 93.49,6.22 91.97,7.75 90.91,7.75 90.15,6.99 84.71,6.99 83.74,7.95 81.36,7.95 80.01,6.6 77.73,6.6 76.68,7.65 74.78,7.65 74.58,7.45 74.58,7.33 73.75,6.5 J8.2
LASER-UART-4
  Top 0.254: J9.4 119.96,99.64 116.84,96.52 116.84,93.85 J2.7
LASER-UART-4_2
  Top 0.254: J3.8 98.57,6.22 97.05,7.75 94.97,7.75 93.95,8.76 | 93.95,8.76 93.73,8.76 | 93.73,8.76 90.49,8.76 89.73,8 85.13,8 84.16,8.97 80.94,8.97 79.59,7.62 78.15,7.62 77.11,8.66 74.36,8.66 73.85,8.16 72.27,8.16 71.77,7.65 69.72,7.65 68.92,6.86 68.58,6.86 68.22,6.5 J8.4 | 93.95,8.76 93.73,8.76
LASER-UART-5
  Top 0.254: J9.5 122.73,99.87 119.38,96.52 119.38,94.11 J2.9
LASER-UART-5_2
  Top 0.254: J3.10 100.6,6.48 99.59,7.49 98.02,7.49 97.26,8.26 95.18,8.26 94.17,9.27 90.28,9.27 89.52,8.51 85.6,8.51 | 85.6,8.51 85.34,8.51 | 85.6,8.51 85.34,8.51 | 85.34,8.51 84.37,9.47 80.73,9.47 79.38,8.13 78.36,8.13 77.32,9.17 74.14,9.17 73.64,8.66 72.06,8.66 71.56,8.16 69.5,8.16 69,7.65 66.94,7.65 66.16,6.86 65.8,6.86 65.44,6.5 J8.5
MAGNET-I2C-SCL
  Top 0.254: J9.11 136.96,97.79 130.94,97.79 J2.16
MAGNET-I2C-SCL_2
  Bottom 0.254: J3.15 109.22,1.78 108.79,1.35 56.13,1.35 54.95,2.52 J8.30
MAGNET-I2C-SDA
  Top 0.254: J9.10 134.7,98.3 130.59,98.3 129.83,97.54 128.52,97.54 127,96.01 127,94.11 J2.13
MAGNET-I2C-SDA_2  (via drill 0.33)
  Top 0.254: J3.14 105.68,6.48 104.67,7.49 103.1,7.49 102.08,8.51 98.44,8.51 97.68,9.27 95.6,9.27 94.59,10.29 89.86,10.29 89.1,9.53 85.76,9.53 84.79,10.49 80.31,10.49 79.28,9.47 v78.87,9.47
  Bottom 0.254: J8.7 59.11,6.79 61.79,9.47 v78.87,9.47
MNGR-3.3V  (via drill 0.33, 0.35, 0.5)
  Top 0.254: U9.4 v139.45,34.04 | U7.4 v139.7,22.86 | U6.4 v139.7,10.92 | U$20.ANODE 14.43,13.16 15.83,13.16 16.76,14.09 v16.76,29.46
  Top 0.61: TP6.TP 71.05,105.09 C13.1
  Top 0.813: C13.1 C14.1 | U5.2 U5.4
  Bottom 0.254: v144.34,23.94 143.26,22.86 v139.7,22.86 138.89,23.67 138.89,25.99 139.45,26.55 v139.45,34.04 | v139.7,10.92 142.49,10.92 v142.75,10.67 | U11.1 v55.12,85.85 | v152.91,22.61 v155.7,22.61
  Bottom 0.406: v16.76,29.46 v15.49,30.73
  Bottom 0.61: v82.55,92.46 82.55,90.42 v80.26,88.14
  pour Top (isolate 0.305, rank 3): 0,0 165.1,0 165.1,106.68 0,106.68
MNGR-5V  (via drill 0.35)
  Top 0.305: 86.11,96.42 87.63,94.89 87.63,93.98 106.94,74.67 106.94,73.03 106.93,73.02 106.93,69.36 106.86,69.29 106.86,66.88 110.74,62.99 124.71,62.99 126.24,61.47 v129.29,61.47 | v129.54,48.26 JP1.2
  Top 0.61: 70.1,98.11 TP5.TP
  Top 0.813: U5.3 87.4,97.56 86.26,96.42 86.11,96.42 82.06,96.42 80.36,98.11 C12.1 C11.1 70.1,98.11 68.61,98.11 U1.3
  Bottom 0.305: v129.29,61.47 129.54,61.21 v129.54,48.26
MUX-SEL-A  (via drill 0.33, 0.35)
  Top 0.254: v147.57,30.99 147.45,31.11 U$18.11 145.16,31.11 143.76,32.51 143.76,35.97 v143.46,36.27 | U$19.11 147.7,18.41 v147.83,18.54
  Bottom 0.254: v147.83,18.54 147.83,19.17 147.53,19.48 147.53,20.15 147.57,20.2 v147.57,30.99 | v143.46,36.27 143.69,36.5 144.73,36.5 147.61,39.38 147.61,40.88 145.82,42.67 144.57,42.67 143.07,44.17 143.07,55.82 137.92,60.96 U8.21
MUX-SEL-B  (via drill 0.33, 0.35)
  Top 0.254: v148.11,32.03 147.75,32.38 U$18.10 144.65,32.38 144.27,32.77 144.27,37.01 v143.98,37.3 | U$19.10 148.21,19.68 v148.34,19.81 | v140.4,57.35 140.4,58.99 U8.20
  Bottom 0.254: v148.34,19.81 148.11,20.04 148.11,30.38 148.38,30.65 148.38,31.32 148.11,31.6 v148.11,32.03 | v143.98,37.3 144.21,37.53 145.05,37.53 147.1,39.59 147.1,40.67 145.61,42.16 144.36,42.16 142.56,43.96 142.56,54.1 142.56,55.24 141.84,55.95 141.8,55.95 v140.4,57.35
MUX-SEL-C  (via drill 0.33, 0.35)
  Top 0.254: v148.77,32.94 148.05,33.66 U$18.9 145.16,33.66 144.78,34.04 144.78,38.04 v144.49,38.33 | U$19.9 148.97,20.95 v149.1,21.08 | v141.51,55.15 141.51,62.96 138.43,66.04 U8.19
  Bottom 0.254: v149.1,21.08 148.61,21.57 148.61,30.16 148.92,30.47 148.92,32.79 v148.77,32.94 | v144.49,38.33 144.72,38.57 145.37,38.57 146.6,39.8 146.6,40.46 145.4,41.66 144.15,41.66 142.05,43.75 142.05,54.62 v141.51,55.15
N$1
  Top 0.254: U$18.5 153.8,29.84 TP-AUX-MUX.TP
N$2
  Top 0.305: TP10.TP 153.42,74.68 153.42,73.15 151.38,71.12 U8.8
N$3
  Top 0.305: TP11.TP 153.42,77.22 153.42,75.95 U8.9
N$4
  Top 0.254: TP12.TP U8.13
N$5  (via drill 0.33)
  Top 0.254: R3.1 2.54,56.87 1.46,57.95 1.46,65.87 1.67,66.08 8.6,66.08 v23.11,51.56 | v74.68,44.2 76.2,42.67 U3.5
  Bottom 0.254: v23.11,51.56 28.96,45.72 39.03,45.72 41.06,43.69 74.17,43.69 v74.68,44.2
N$6
  Top 0.305: TP13.TP U8.12
N$7
  Top 0.305: TP14.TP 153.42,82.3 153.42,81.03 U8.11
N$8  (via drill 0.33)
  Top 0.254: R5.1 4.38,65.08 v4.57,65.28
  Bottom 0.254: v4.57,65.28 106.17,65.28 U2.5
N$9  (via drill 0.35)
  Top 0.254: R23.1 124.71,32.7 | 124.71,32.7 124.71,31.75 125.47,30.99 Q1.1 | R24.2 156.91,71.21 159.26,68.86 159.26,62.03 160.93,60.36 160.93,45.86 158,42.93 132.75,42.93 132.33,42.51 132.33,40.13 v132.08,39.88 | v125.73,33.53 124.9,32.7 124.71,32.7
  Bottom 0.254: v132.08,39.88 131.32,39.12 127.25,39.12 125.73,37.59 v125.73,33.53
N$10  (via drill 0.33)
  Top 0.254: Q2.1 62.48,31.47 62.48,32.7 R25.1 v63.75,33.27 | v123.19,43.43 126.24,46.48 156.4,46.48 156.91,46.99 R28.2
  Bottom 0.254: v123.19,43.43 101.64,43.43 98.84,40.64 96.01,40.64 92.46,37.08 67.56,37.08 v63.75,33.27
N$11  (via drill 0.35, 0.51)
  Top 0.254: D1.A 122.8,19.2 R7.2 123.85,18.54 v124.97,18.54 | U6.5 140.34,8.51 139.19,7.37 136.99,7.37 135.89,8.47 135.89,14.09 v134.98,15
  Top 1.27: R7.2 Q1.4
  Bottom 0.254: v124.97,18.54 125.42,19 128.95,19 132.05,15.91 133.68,15.91 134.28,15.3 134.68,15.3 v134.98,15
N$12  (via drill 0.35, 0.51)
  Top 0.254: D2.A 57.54,15.78 R8.2 61.62,18.54 v62.74,18.54 | v132.76,27.01 135.4,27.01 137.1,28.7 139.7,28.7 140.34,28.07 U7.10
  Top 1.27: Q2.4 R8.2
  Bottom 0.254: v62.74,18.54 69.65,18.54 71.05,19.94 72.21,19.94 72.59,19.56 78.38,19.56 79.77,20.95 81.77,20.95 82.15,20.57 86.59,20.57 87.99,21.97 90.83,21.97 91.21,21.59 95.2,21.59 96.67,23.06 100.64,23.06 101.09,22.61 103.31,22.61 104.71,24 109.45,24 109.78,23.67 112.3,23.67 114.74,26.11 132.28,26.11 132.33,26.16 132.34,26.16 132.76,26.58 v132.76,27.01
N$13  (via drill 0.33)
  Top 0.254: Q3.1 106.93,31.47 106.93,32.7 R26.1 106.36,34.99 v106.43,35.05 | v129.82,40.61 129.82,41.44 132.33,43.94 157.58,43.94 159.92,46.28 159.92,59.94 158.24,61.61 158.24,64.45 R29.2
  Bottom 0.254: v106.43,35.05 106.43,39.88 107.26,40.71 121.91,40.71 122.31,40.31 129.52,40.31 v129.82,40.61
N$14  (via drill 0.35, 0.51)
  Top 0.254: D3.A 101.99,15.78 R9.2 106.07,18.54 v107.19,18.54 | U6.12 139.06,17.14 138.68,17.53 134.16,17.53 133.14,18.54 132.71,18.54 131.52,19.73 131.52,19.82 v131.22,20.12
  Top 1.27: Q3.4 R9.2
  Bottom 0.254: v107.19,18.54 114.36,18.54 116.85,21.03 130.09,21.03 130.7,20.43 130.92,20.43 v131.22,20.12
N$15  (via drill 0.33)
  Top 0.254: Q4.1 71.37,31.47 71.37,32.7 R27.1 v72.64,33.27 | R30.2 156.91,49.87 157.89,48.89 157.89,47.12 156.74,45.97 127.46,45.97 124.71,43.22 v124.71,42.63
  Bottom 0.254: v72.64,33.27 75.95,36.58 92.67,36.58 96.22,40.13 99.05,40.13 101.85,42.93 122.57,42.93 122.86,42.63 v124.71,42.63
N$16  (via drill 0.35, 0.51)
  Top 0.254: D4.A 66.43,15.78 69.77,19.13 | 69.77,19.13 R10.2 | R10.2 70.51,18.54 v71.63,18.54 | v134.87,25.85 135.52,25.85 136.55,26.88 136.55,27.44 137.31,28.19 138.39,28.19 139.06,27.52 U7.12 | R10.2 69.77,19.13
  Top 1.27: Q4.4 R10.2 69.77,19.13
  Bottom 0.254: v71.63,18.54 78.8,18.54 80.19,19.94 81.35,19.94 81.73,19.56 87.01,19.56 88.41,20.95 90.41,20.95 90.79,20.57 95.62,20.57 97.09,22.05 100.21,22.05 100.67,21.59 103.73,21.59 105.13,22.99 109.03,22.99 109.36,22.66 112.72,22.66 115.16,25.09 132.71,25.09 133.46,25.85 v134.87,25.85
N$17
  Top 0.254: R11.2 U$9.CATHODE
N$18
  Top 0.254: R12.2 U$10.CATHODE
N$19
  Top 0.254: R19.2 U$17.CATHODE
N$20
  Top 0.254: R22.2 U$20.CATHODE
N$21  (via drill 0.33)
  Top 0.254: Q10.1 44.7,31.47 44.7,32.7 R42.1 v45.97,33.27 | v127.25,70.61 R40.2
  Bottom 0.254: v45.97,33.27 50.8,38.1 87.31,38.1 90.87,41.66 98.42,41.66 107.63,50.87 119.13,50.87 120.58,52.32 120.58,69.34 121.85,70.61 v127.25,70.61
N$22  (via drill 0.35, 0.51)
  Top 0.254: D10.A 42.79,19.2 R13.2 43.84,18.54 v45.21,18.54 | U9.3 138.81,31.37 138.39,30.95 136.47,30.95 135.49,29.97 132.07,29.97 130.7,28.59 130.7,28.34 130.3,27.94 129.79,27.94 v129.29,28.45
  Top 1.27: R13.2 Q10.4
  Bottom 0.254: v45.21,18.54 51.87,18.54 53.27,19.94 54.43,19.94 54.81,19.56 60.34,19.56 61.74,20.95 63.74,20.95 64.12,20.57 68.81,20.57 70.21,21.97 73.05,21.97 73.43,21.59 77.53,21.59 78.93,22.99 82.61,22.99 82.99,22.61 85.75,22.61 87.15,24 91.67,24 92.05,23.62 94.36,23.62 95.83,25.09 102.93,25.09 103.87,26.04 111.79,26.04 113.9,28.14 128.98,28.14 v129.29,28.45
N$23  (via drill 0.33)
  Top 0.254: Q8.1 98.04,31.47 98.04,32.7 R41.1 97.54,33.34 v97.54,35.05 | v128.78,41.11 132.12,44.45 157.37,44.45 159.41,46.49 159.41,59.73 R39.2
  Bottom 0.254: v97.54,35.05 97.54,38.35 97.79,38.61 99.68,38.61 102.29,41.22 122.12,41.22 122.52,40.82 127.84,40.82 128.24,41.22 128.67,41.22 v128.78,41.11
N$24  (via drill 0.35, 0.51)
  Top 0.254: D8.A 93.1,15.78 R14.2 97.18,18.54 v98.55,18.54 | v132.33,20.07 134.37,18.03 139.45,18.03 140.34,17.14 U6.10
  Top 1.27: Q8.4 R14.2
  Bottom 0.254: v98.55,18.54 105,18.54 106.39,19.94 107.77,19.94 108.1,19.61 113.99,19.61 116.42,22.05 131.37,22.05 132.33,21.08 v132.33,20.07
N$25  (via drill 0.33)
  Top 0.254: Q9.1 53.59,31.47 53.59,32.7 R38.1 v54.86,33.27 | v127.25,66.8 R34.2
  Bottom 0.254: v54.86,33.27 59.18,37.59 87.53,37.59 91.08,41.15 98.63,41.15 107.84,50.36 119.34,50.36 121.09,52.11 121.09,65.79 122.11,66.8 v127.25,66.8
N$26  (via drill 0.35, 0.51)
  Top 0.254: D9.A 51.68,19.2 R15.2 52.73,18.54 v53.85,18.54 | U9.5 140.08,30.86 139.66,30.44 136.68,30.44 135.7,29.46 132.71,29.46 v131.51,28.26
  Top 1.27: R15.2 Q9.4
  Bottom 0.254: v53.85,18.54 60.76,18.54 62.16,19.94 63.32,19.94 63.7,19.56 69.23,19.56 70.63,20.95 72.63,20.95 73.01,20.57 77.95,20.57 79.35,21.97 82.19,21.97 82.57,21.59 86.17,21.59 87.57,22.99 91.25,22.99 91.63,22.61 94.78,22.61 96.25,24.08 101.06,24.08 101.51,23.62 102.89,23.62 104.29,25.02 109.87,25.02 110.2,24.69 111.88,24.69 114.32,27.13 130.38,27.13 v131.51,28.26
N$27  (via drill 0.33)
  Top 0.254: Q7.1 89.91,30.74 89.15,31.5 89.15,32.7 R37.1 v90.42,33.27 | R33.2 158.9,56.68 158.9,46.7 157.16,44.96 130.85,44.96 v127.51,41.62
  Bottom 0.254: v90.42,33.27 90.42,34.04 91.95,35.56 93.09,35.56 96.64,39.12 99.47,39.12 102.27,41.91 122.15,41.91 122.73,41.33 126.57,41.33 127.15,41.91 127.22,41.91 v127.51,41.62
N$28  (via drill 0.35, 0.51)
  Top 0.254: D7.A 84.21,15.78 R16.2 88.29,18.54 v89.41,18.54 | v133.85,22.6 134.62,21.84 134.62,20.87 135.93,19.56 139.19,19.56 140.34,20.7 U7.5
  Top 1.27: R16.2 Q7.4
  Bottom 0.254: v89.41,18.54 96.46,18.54 97.94,20.02 99.37,20.02 99.83,19.56 104.58,19.56 105.97,20.95 108.19,20.95 108.52,20.62 113.56,20.62 116,23.06 133.4,23.06 v133.85,22.6
N$29  (via drill 0.33)
  Top 0.254: Q6.1 80.26,31.47 80.26,32.7 R36.1 v81.53,33.27 | R32.2 158.39,53.63 158.39,46.91 156.95,45.47 129.03,45.47 126.24,42.67 v126.24,42.13
  Bottom 0.254: v81.53,33.27 84.33,36.07 92.88,36.07 96.43,39.62 99.26,39.62 102.06,42.42 122.36,42.42 122.94,41.83 125.95,41.83 v126.24,42.13
N$30  (via drill 0.35, 0.51)
  Top 0.254: D6.A 75.32,15.78 R17.2 79.4,18.54 v80.77,18.54 | v133.86,24.38 133.86,23.75 135,22.61 135.13,22.61 135.13,21.08 136.14,20.07 138.28,20.07 139.06,20.85 U7.3
  Top 1.27: Q6.4 R17.2
  Bottom 0.254: v80.77,18.54 87.43,18.54 88.83,19.94 89.99,19.94 90.37,19.56 96.04,19.56 97.51,21.03 99.79,21.03 100.25,20.57 104.16,20.57 105.55,21.97 108.61,21.97 108.94,21.64 113.14,21.64 115.58,24.08 133.56,24.08 v133.86,24.38
N$31  (via drill 0.33)
  Top 0.254: Q5.1 115.82,31.47 115.82,32.7 R35.1 115.25,34.73 v115.32,34.8 | v130.92,40.39 130.92,41.81 132.54,43.43 157.79,43.43 160.43,46.07 160.43,60.15 158.75,61.82 158.75,67.5 R31.2
  Bottom 0.254: v115.32,34.8 120.65,40.13 121.77,40.13 122.1,39.8 130.15,39.8 130.73,40.39 v130.92,40.39
N$32  (via drill 0.35, 0.51)
  Top 0.254: D5.A 113.91,19.2 R18.2 114.96,18.54 v116.33,18.54 | U6.3 139.06,8.76 138.18,7.87 137.2,7.87 136.4,8.68 136.4,14.94 v136.1,15.24
  Top 1.27: R18.2 Q5.4
  Bottom 0.254: v116.33,18.54 117.81,20.02 129.38,20.02 132.47,16.92 135.48,16.92 136.14,16.26 136.14,15.29 v136.1,15.24
N$33
  Top 0.305: TP15.TP 153.42,79.76 153.42,78.49 U8.10
N$34  (via drill 0.35, 0.51)
  Top 0.254: D11.A 33.9,19.2 R20.2 34.95,18.54 v36.07,18.54 | v133.54,31.31 135.64,33.4 135.64,38.31 136.95,39.62 138.13,39.62 138.81,38.95 U9.12
  Top 1.27: R20.2 Q11.4
  Bottom 0.254: v36.07,18.54 43.24,18.54 44.63,19.94 45.79,19.94 46.17,19.56 51.45,19.56 52.85,20.95 54.85,20.95 55.23,20.57 59.92,20.57 61.32,21.97 64.16,21.97 64.54,21.59 68.39,21.59 69.79,22.99 73.47,22.99 73.85,22.61 77.11,22.61 78.51,24 83.03,24 83.42,23.62 85.33,23.62 86.72,25.02 92.23,25.02 92.61,24.64 93.94,24.64 95.41,26.11 102.51,26.11 103.45,27.05 111.37,27.05 113.48,29.16 128.13,29.16 129.57,30.59 132.83,30.59 v133.54,31.31
N$35
  Top 0.305: TP16.TP 133.35,64.77 133.35,67.31 134.62,68.58 U8.18
N$36  (via drill 0.35, 0.51)
  Top 0.254: D12.A 25.01,19.2 R21.2 26.06,18.54 v27.43,18.54 | U9.10 140.08,39.24 139.19,40.13 136.74,40.13 135.13,38.52 135.13,33.87 134.28,33.02 v133.35,33.02
  Top 1.27: Q12.4 R21.2
  Bottom 0.254: v27.43,18.54 34.09,18.54 35.49,19.94 36.65,19.94 37.03,19.56 42.81,19.56 44.21,20.95 46.21,20.95 46.59,20.57 51.03,20.57 52.43,21.97 55.27,21.97 55.65,21.59 59.5,21.59 60.9,22.99 64.58,22.99 64.96,22.61 67.97,22.61 69.37,24 69.85,24 73.89,24 74.27,23.62 76.69,23.62 78.09,25.02 83.45,25.02 83.84,24.64 84.91,24.64 86.3,26.04 93.9,26.04 94.99,27.13 102.09,27.13 103.03,28.07 110.95,28.07 113.06,30.18 127.71,30.18 129.15,31.61 131.94,31.61 v133.35,33.02
N$37
  Top 0.305: JP1.1 U8.VIN
N$38
  Top 0.305: JP2.1 U8.3.3V
N$40  (via drill 0.33)
  Top 0.254: Q11.1 35.81,31.47 35.81,32.7 R45.1 v37.08,33.27 | v127.25,74.42 R43.2
  Bottom 0.254: v37.08,33.27 42.42,38.61 87.1,38.61 90.66,42.16 98.21,42.16 107.42,51.38 118.92,51.38 120.07,52.53 120.07,70.33 124.16,74.42 v127.25,74.42
N$43  (via drill 0.33)
  Top 0.254: Q12.1 27.68,30.99 27.68,31.25 26.92,32 26.92,32.7 R46.1 27.69,33.27 v28.45,33.27 | v127.25,78.23 127.51,78.49 R44.2
  Bottom 0.254: v127.25,78.23 119.56,70.54 119.56,52.74 118.71,51.88 107.21,51.88 98,42.67 90.45,42.67 86.96,39.19 31.57,39.19 28.45,36.07 v28.45,33.27
STATIC-I2C-SCL
  Top 0.254: J2.14 125.73,95.5 128.27,98.04 129.62,98.04 130.38,98.81 132.44,98.81 J9.9
STATIC-I2C-SCL_2
  Bottom 0.254: J3.13 106.68,2.29 106.25,1.85 58.6,1.85 57.73,2.73 J8.31
STATIC-I2C-SDA
  Top 0.254: J9.8 129.41,98.55 127.36,98.55 126.85,98.04 126.11,98.04 J2.12
STATIC-I2C-SDA_2
  Bottom 0.254: J3.11 102.82,2.36 60.88,2.36 60.49,2.75 J8.32
SUPPLY_FOR_5V-DIG
  Top 0.61: J1.4 34.19,93.32 TP2.TP
  Top 1.016: U2.2 88.39,90.68 78.74,90.68 | C8.1 78.74,90.68 | J1.4 39.12,95.25 60.45,95.25 65.02,90.68 78.74,90.68
SUPPLY_FOR_ACT
  Top 0.254: C1.1 C3.1 | TP3.TP 13.97,104.65 24.44,104.65
  Top 0.61: C1.1 5.58,85.59 6.35,86.36 U4.1
  Top 2.286: 25.65,105.21 28.4,105.21 28.45,105.16
  Top 2.54: U4.1 23.11,87.38 23.11,90.42 | 23.11,90.42 40.56,90.42 42.85,88.14 66.8,88.14 U3.1 | 23.11,90.42 23.11,103.33 24.44,104.65 25,105.21 25.65,105.21 | 28.45,105.16 30.08,103.52 J1.10
SUPPLY_FOR_MNGR
  Top 0.61: U1.1 69.06,92.58 C4.1
  Bottom 0.254: J1.1 24.85,99.06 20.83,99.06 20.07,98.3 14.22,98.3 TP4.TP
  Bottom 0.61: J1.1 29.63,96.52 U1.1
TEMP-5V-20W  (via drill 0.35)
  Top 0.254: U$19.4 153.03,15.88 154.69,17.53 154.69,26.97 156.35,28.63 156.35,37.11 151.04,42.42 133.6,42.42 v133.3,42.12 | U12.2 105.79,92.58 107.7,90.68 v107.7,68.94 | v128.77,63.25 125.23,66.79 v114.3,66.79
  Bottom 0.254: v133.3,42.12 132.64,42.12 128.27,46.48 128.27,61.98 128.77,62.48 v128.77,63.25 | v114.3,66.79 110.57,66.79 108.45,68.9 107.74,68.9 v107.7,68.94
TEMP-5V-30W  (via drill 0.35)
  Top 0.254: U$19.5 153.29,17.14 154.18,18.03 154.18,27.18 155.84,28.84 155.84,36.9 150.83,41.91 134.82,41.91 v134.34,41.43 | v127.51,63.25 125.23,65.52 v114.3,65.52 | v56.39,81.03 v56.39,69.34
  Bottom 0.254: U11.2 58.29,92.58 59.18,91.69 59.18,84.84 56.39,82.04 v56.39,81.03 | v134.34,41.43 134.01,41.43 133.89,41.31 132.73,41.31 127.51,46.53 v127.51,63.25 | v114.3,65.52 110.6,65.52 107.99,68.14 57.59,68.14 v56.39,69.34
TEMP-12V-30W  (via drill 0.35)
  Top 0.254: U$18.4 152.78,28.57 152.91,28.45 154.69,28.45 155.33,29.1 155.33,36.69 150.62,41.4 135.89,41.4 v135.13,40.64 | v126.25,63.25 125.23,64.26 v114.3,64.26 | v19.05,70.1 19.05,84.84 v18.8,84.84
  Bottom 0.254: v135.13,40.64 134.7,40.64 134.68,40.62 132.7,40.62 126.75,46.57 126.75,62.61 126.25,63.11 v126.25,63.25 | v114.3,64.26 110.7,64.26 107.65,67.31 21.84,67.31 v19.05,70.1 | U10.2 20.45,92.58 21.59,91.44 21.59,89.66 18.8,86.87 v18.8,84.84
USB-CAM-2_N  (via drill 0.33)
  Top 0.254: J8.26 45.55,5.33 45.72,5.33 48.77,5.33 76.71,5.33 78.21,5.33 v78.26,5.28
  Bottom 0.254: 87.12,9.91 82.19,9.91 78.99,6.71 78.99,6.02 v78.26,5.28 | J3.18 111.76,6.6 110.74,7.62 110.74,9.25 110.09,9.91 108.97,9.91 103.65,9.91 87.12,9.91 | 87.12,9.91
USB-CAM-2_P  (via drill 0.33)
  Top 0.254: J8.27 47.81,4.83 48.51,4.83 48.77,4.83 76.71,4.83 77.22,4.32 78.94,4.32 v79.35,4.72
  Bottom 0.254: J3.16 110.24,7.24 110.24,9.04 109.88,9.4 108.97,9.4 arc90 108.52,8.95 108.52,8.89 arc-90 108.08,8.44 107.49,8.44 arc-90 107.05,8.89 107.05,8.95 arc90 106.6,9.4 106.01,9.4 arc90 105.57,8.95 105.57,8.89 arc-90 105.12,8.44 104.54,8.44 arc-90 104.09,8.89 104.09,8.95 arc90 103.65,9.4 82.4,9.4 79.5,6.5 79.5,5.81 79.35,5.66 v79.35,4.72

## Text on the board
tPlace: ACT / SUP | MGR / SUPP | 5V / ACT | 5V / DIG | GND | SUPP / 5V-DIG | 12V_C | 5VA_C | 5VD_C | 12V | CSM Rocksat-X Power Distribution Board / Rev1 01/26/2020 / By: Mark Gilliland & Graham Braly
Document: Designed for 2oz pour / / Trace Width Cheat-Sheet (20C Rise) / 5A: 150 mil (or 100) / 4A: 100 mil / 3A: 65 mil / 2A: 40 mil / 1A: 15 mil (30 mil for 5C rise) / <0.6A 10 mil | Using Sparkfun's "Standard" Design Rules (8 mil clearance) but changed it to allow for 13.77 mil vias
tDocu: Teensy / 3.3V | Teensy / 5V | 12V | 5VA | 5VD | 12V / STA | 12V / CAM | 5VA / MAG | 5VA / STA | 5VA / TX | 5VA / LAS | 5VA / CAM | 5VD / STA | 5VD / MAG | 5VD / LAS | 5VD / CAM | 5VD / TX | MNGR